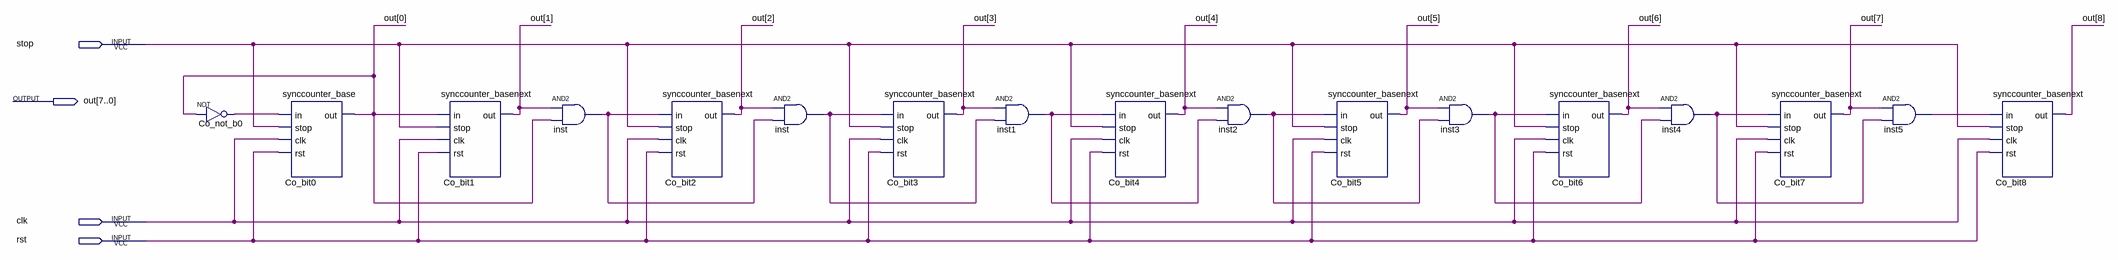
[diagram p0: schematic sheet]
// Quartus schematic synccounter8.bdf as structural Verilog: 17 symbols, 4 pins
module synccounter8 (
  input  stop,
  input  clk,
  input  rst,
  output [8:0] out
);

  wire Co_not_b0_out, inst1_out, inst2_out, inst3_out, inst4_out, inst5_out, inst_out, inst_out_2;

  not Co_not_b0 (Co_not_b0_out, out[0]);
  synccounter_base Co_bit0 (.in(Co_not_b0_out), .stop(stop), .clk(clk), .rst(rst), .out(out[0]));
  synccounter_basenext Co_bit1 (.in(out[0]), .stop(stop), .clk(clk), .rst(rst), .out(out[1]));
  and inst (inst_out, out[1], out[0]);
  synccounter_basenext Co_bit2 (.in(inst_out), .stop(stop), .clk(clk), .rst(rst), .out(out[2]));
  and inst_dup2 (inst_out_2, out[2], inst_out);
  synccounter_basenext Co_bit3 (.in(inst_out_2), .stop(stop), .clk(clk), .rst(rst), .out(out[3]));
  and inst1 (inst1_out, out[3], inst_out_2);
  synccounter_basenext Co_bit4 (.in(inst1_out), .stop(stop), .clk(clk), .rst(rst), .out(out[4]));
  and inst2 (inst2_out, out[4], inst1_out);
  synccounter_basenext Co_bit5 (.in(inst2_out), .stop(stop), .clk(clk), .rst(rst), .out(out[5]));
  and inst3 (inst3_out, out[5], inst2_out);
  synccounter_basenext Co_bit6 (.in(inst3_out), .stop(stop), .clk(clk), .rst(rst), .out(out[6]));
  and inst4 (inst4_out, out[6], inst3_out);
  synccounter_basenext Co_bit7 (.in(inst4_out), .stop(stop), .clk(clk), .rst(rst), .out(out[7]));
  and inst5 (inst5_out, out[7], inst4_out);
  synccounter_basenext Co_bit8 (.in(inst5_out), .stop(stop), .clk(clk), .rst(rst), .out(out[8]));
endmodule
